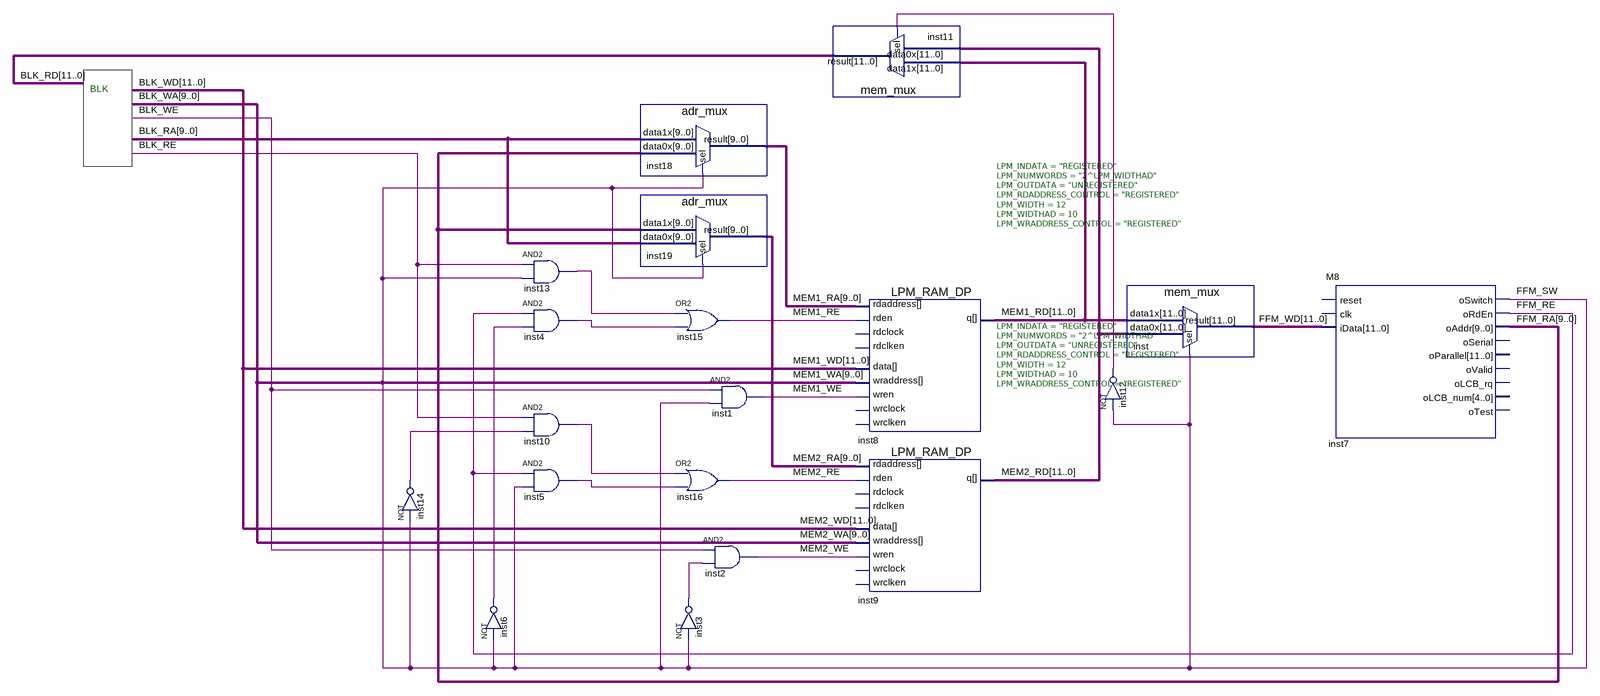
[diagram p0: schematic sheet]
// Quartus schematic scheme.bdf as structural Verilog: 19 symbols, 0 pins
module scheme (
);

  wire BLK_RE, BLK_WE, FFM_RE, FFM_SW, inst3_out, inst4_out, inst5_out, inst6_out, inst10_out, inst12_out,
       inst13_out, inst14_out, MEM1_RE, MEM1_WE, MEM2_RE, MEM2_WE;
  wire [9:0] BLK_RA, FFM_RA, MEM1_RA, MEM1_WA, MEM2_RA, MEM2_WA;
  wire [11:0] BLK_RD, FFM_WD, MEM1_RD, MEM1_WD, MEM2_RD, MEM2_WD;

  not inst14 (inst14_out, FFM_SW);
  and inst13 (inst13_out, BLK_RE, FFM_SW);
  and inst4 (inst4_out, FFM_RE, inst6_out);
  and inst10 (inst10_out, BLK_RE, inst14_out);
  and inst5 (inst5_out, FFM_RE, FFM_SW);
  not inst6 (inst6_out, FFM_SW);
  adr_mux inst18 (.data1x(BLK_RA), .data0x(FFM_RA), .sel(FFM_SW), .result(MEM1_RA));
  adr_mux inst19 (.data1x(FFM_RA), .data0x(BLK_RA), .sel(FFM_SW), .result(MEM2_RA));
  or inst15 (MEM1_RE, inst13_out, inst4_out);
  or inst16 (MEM2_RE, inst10_out, inst5_out);
  not inst3 (inst3_out, FFM_SW);
  and inst1 (MEM1_WE, BLK_WE, FFM_SW);
  and inst2 (MEM2_WE, BLK_WE, inst3_out);
  mem_mux inst11 (.data1x(MEM1_RD), .data0x(MEM2_RD), .sel(inst12_out), .result(BLK_RD));
  LPM_RAM_DP #(.LPM_INDATA("REGISTERED"), .LPM_NUMWORDS("2^LPM_WIDTHAD"), .LPM_OUTDATA("UNREGISTERED"), .LPM_RDADDRESS_CONTROL("REGISTERED"), .LPM_WIDTH(12), .LPM_WIDTHAD(10), .LPM_WRADDRESS_CONTROL("REGISTERED")) inst8 (
    .rden(MEM1_RE), .wren(MEM1_WE), .rdaddress(MEM1_RA), .data(MEM1_WD), .wraddress(MEM1_WA), .q(MEM1_RD));  // open: rdclock, rdclken, wrclock, wrclken
  LPM_RAM_DP #(.LPM_INDATA("REGISTERED"), .LPM_NUMWORDS("2^LPM_WIDTHAD"), .LPM_OUTDATA("UNREGISTERED"), .LPM_RDADDRESS_CONTROL("REGISTERED"), .LPM_WIDTH(12), .LPM_WIDTHAD(10), .LPM_WRADDRESS_CONTROL("REGISTERED")) inst9 (
    .rden(MEM2_RE), .wren(MEM2_WE), .rdaddress(MEM2_RA), .data(MEM2_WD), .wraddress(MEM2_WA), .q(MEM2_RD));  // open: rdclock, rdclken, wrclock, wrclken
  mem_mux inst (.data1x(MEM1_RD), .data0x(MEM2_RD), .sel(FFM_SW), .result(FFM_WD));
  not inst12 (inst12_out, FFM_SW);
  M8 inst7 (
    .iData(FFM_WD), .oSwitch(FFM_SW), .oRdEn(FFM_RE), .oAddr(FFM_RA));  // open: reset, clk, oSerial, oParallel, oValid, oLCB_rq, oLCB_num, oTest

  // Notes on the sheet:
  //   BLK
endmodule
